# EAGLE schematic ELL-i-Passives (EAGLE 6.4)
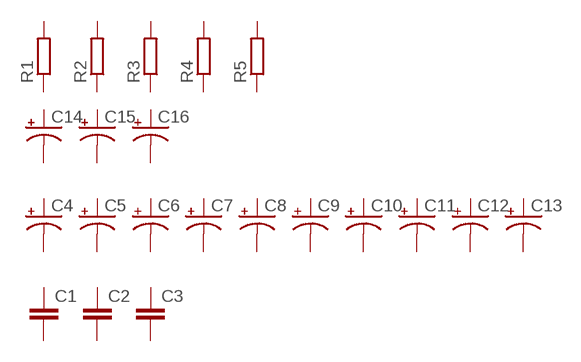
[diagram p0: schematic, sheet 1]

## Parts
C1  C0402  [C0402]
C2  C0603  [C0603]
C3  C0805  [C0805]
C4  CPOL1206  [CT3216]
C5  CPOL3528  [CT3528]
C6  CPOL6032  [CT6032]
C7  CPOL7343  [CT7343]
C8  CPOLC  [CPOL_PANASONIC_C]
C9  CPOLD  [CPOL_PANASONIC_D]
C10  CPOLE  [CPOL_PANASONIC_E]
C11  CPOLF80  [CPOL_NIPPON_F80]
C12  CPOLG  [CPOL_PANASONIC_G]
C13  CPOLH13  [CPOL_PANASONIC_H13]
C14  CPOLPTH1  [CPOL-RADIAL-100UF-25V]
C15  CPOLPTH2  [CPOL-RADIAL-10UF-25V]
C16  CPOLPTH4  [CPOL-RADIAL-1000UF-25V]
R1  R0402  [R0402]
R2  R0603  [R0603]
R3  R0805  [R0805]
R4  R1206  [R1206]
R5  R2512  [R2512]
Unconnected: C1.1 C1.2 C2.1 C2.2 C3.1 C3.2 C4.A(+) C4.C(-) C5.A(+) C5.C(-) C6.P$1(+) C6.P$2(-) C7.A(+) C7.C(-) C8.+ C8.- C9.+ C9.- C10.+ C10.- C11.+ C11.- C12.+ C12.- C13.+ C13.- C14.1(+) C14.2(-) C15.1(+) C15.2(-) C16.1(+) C16.2(-) R1.1 R1.2 R2.1 R2.2 R3.1 R3.2 R4.1 R4.2 R5.1 R5.2

## Library data of the parts
C1-C3 = ELL-i-Passives:C: Surface Mount Capasitor — in standard sizes
C4-C16 = ELL-i-Passives:CPOL: Polarized Capacitor — common SMD and some through-hole ones These are standard surface mount (SMD) and through-hole (PTH) capacitors. Normally 10uF, 47uF, and 100uF in electrolytic and tantalum varieties. Always verify the external diameter of the through hole cap, it varies with capacity, voltage, and manufacturer. The EIA tantalum devices should have standard packages. Copied from SparkFun-Passives.lbr under SparkFun Creative Commons license. Adopted to EagleUp usage through renaming the packages appropriately.
R1-R5 = ELL-i-Passives:R: Surface Mount Resistor — in standard sizes